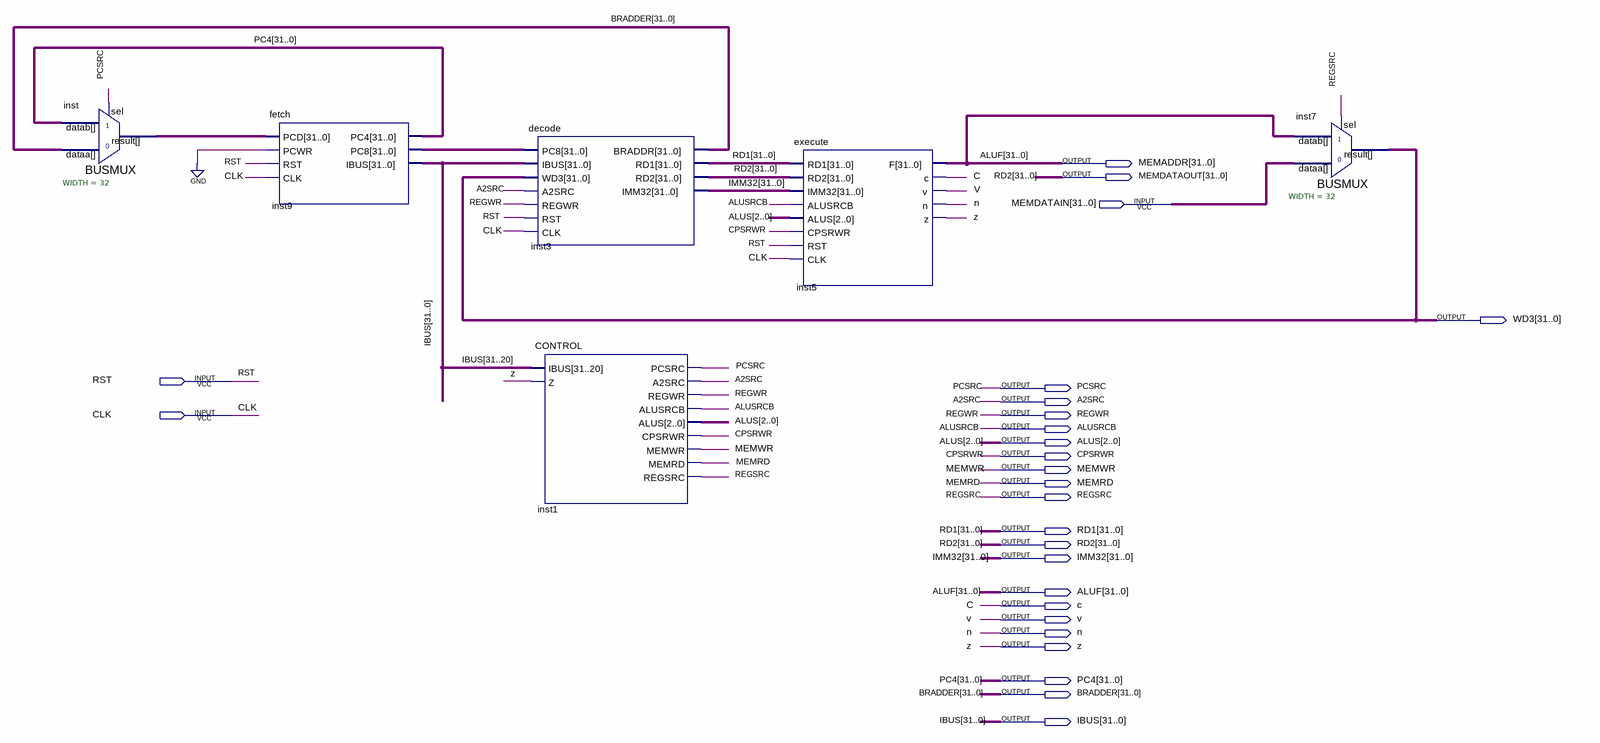
[diagram p0: schematic sheet]
// Quartus schematic scp.bdf as structural Verilog: 6 symbols, 26 pins
module scp (
  input  [31:0] MEMDATAIN,
  input  RST,
  input  CLK,
  output [31:0] MEMADDR,
  output [31:0] MEMDATAOUT,
  output [31:0] WD3,
  output PCSRC,
  output A2SRC,
  output REGWR,
  output ALUSRCB,
  output [2:0] ALUS,
  output CPSRWR,
  output MEMWR,
  output MEMRD,
  output REGSRC,
  output [31:0] RD1,
  output [31:0] RD2,
  output [31:0] IMM32,
  output [31:0] ALUF,
  output c,
  output v,
  output n,
  output z,
  output [31:0] PC4,
  output [31:0] BRADDER,
  output [31:0] IBUS
);

  wire [31:0] inst9_pc8, inst_result;

  BUSMUX #(.WIDTH(32)) inst (.datab(PC4), .sel(PCSRC), .dataa(BRADDER), .result(inst_result));
  fetch inst9 (.PCD(inst_result), .PCWR(1'b0), .RST(RST), .CLK(CLK), .PC4(PC4), .PC8(inst9_pc8), .IBUS(IBUS));
  decode inst3 (
    .PC8(inst9_pc8), .IBUS(IBUS), .WD3(WD3), .A2SRC(A2SRC), .REGWR(REGWR), .RST(RST), .CLK(CLK),
    .BRADDR(BRADDER), .RD1(RD1), .RD2(MEMDATAOUT), .IMM32(IMM32));
  CONTROL inst1 (
    .IBUS(IBUS[31:20]), .Z(z), .PCSRC(PCSRC), .A2SRC(A2SRC), .REGWR(REGWR), .ALUSRCB(ALUSRCB), .ALUS(ALUS),
    .CPSRWR(CPSRWR), .MEMWR(MEMWR), .MEMRD(MEMRD), .REGSRC(REGSRC));
  execute inst5 (
    .RD1(RD1), .RD2(MEMDATAOUT), .IMM32(IMM32), .ALUSRCB(ALUSRCB), .ALUS(ALUS), .CPSRWR(CPSRWR), .RST(RST),
    .CLK(CLK), .F(ALUF), .c(c), .v(v), .n(n), .z(z));
  BUSMUX #(.WIDTH(32)) inst7 (.datab(ALUF), .sel(REGSRC), .dataa(MEMDATAIN), .result(WD3));

  assign MEMADDR = ALUF;
  assign RD2 = MEMDATAOUT;
endmodule
